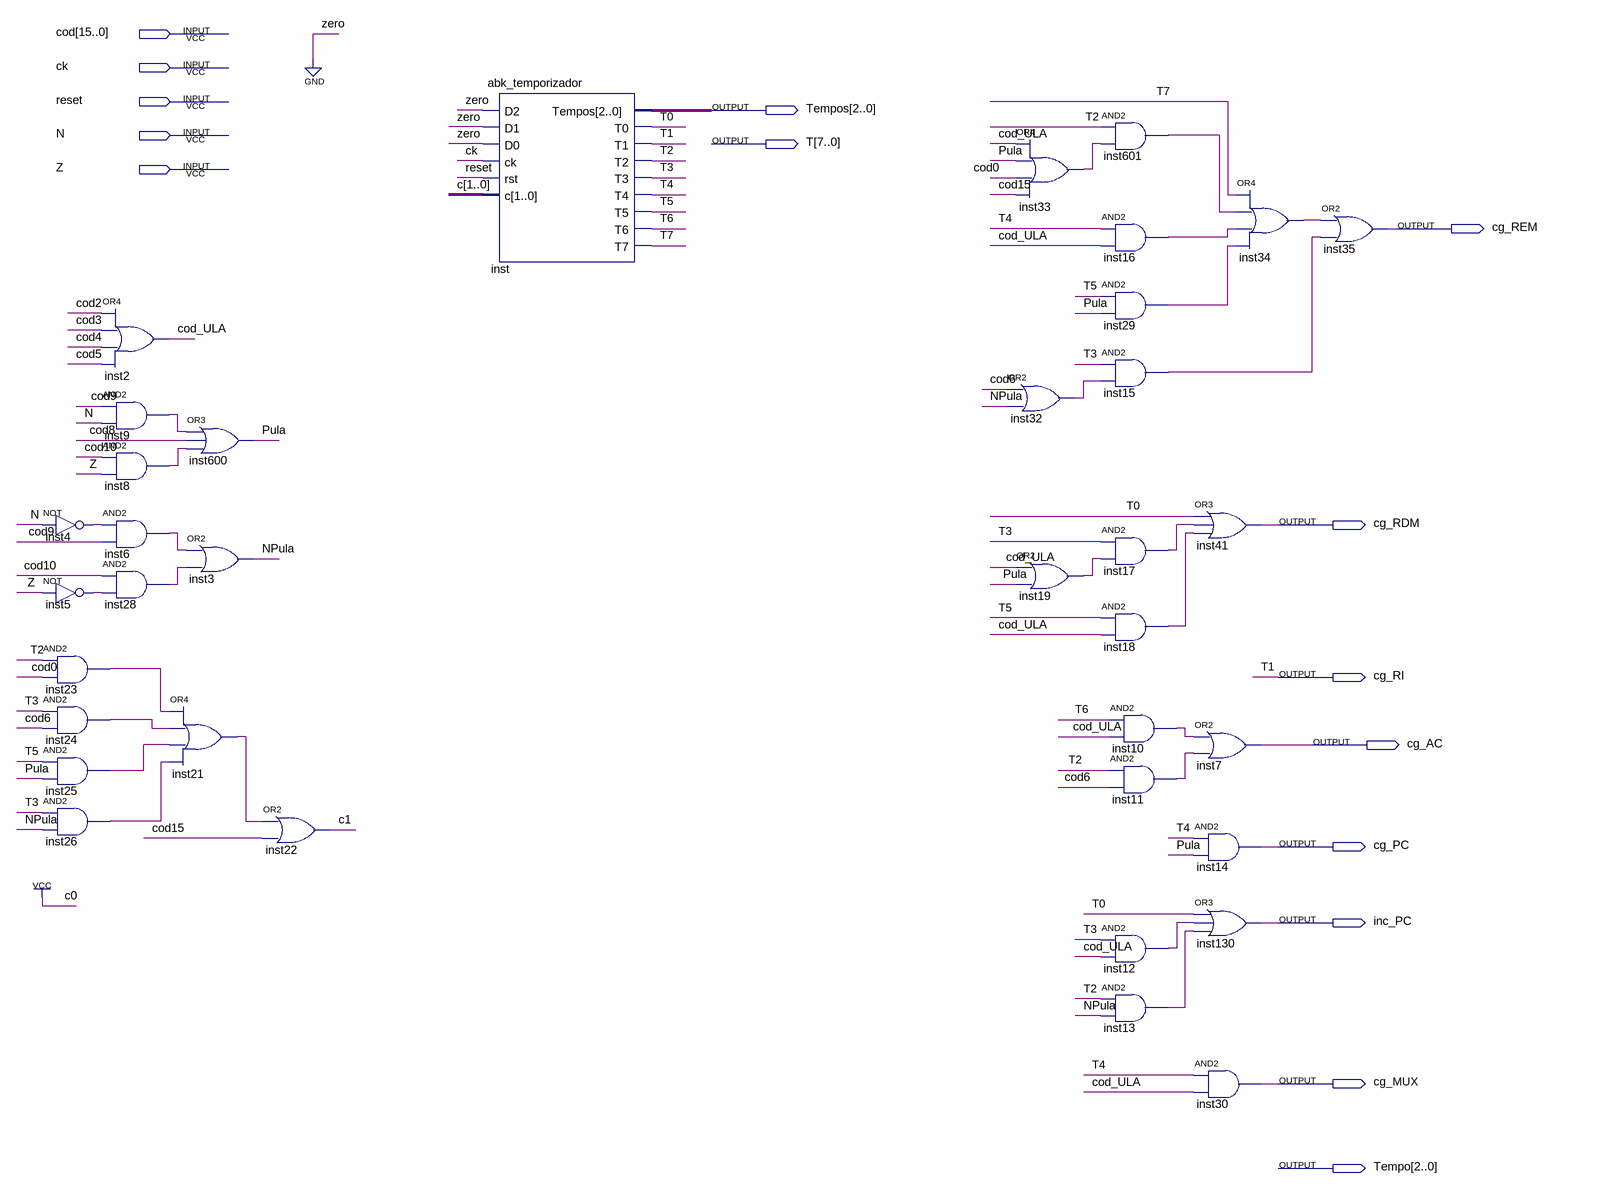
[diagram p0: schematic sheet]
// Quartus schematic abk_novo_cerebro.bdf as structural Verilog: 36 symbols, 15 pins
module abk_novo_cerebro (
  input  [15:0] cod,
  input  ck,
  input  reset,
  input  N,
  input  Z,
  output [2:0] Tempos,
  output [7:0] T,
  output cg_REM,
  output cg_RDM,
  output cg_RI,
  output cg_AC,
  output cg_PC,
  output inc_PC,
  output cg_MUX,
  output [2:0] Tempo
);

  wire cod_ULA, inst4_out, inst5_out, inst6_out, inst8_out, inst9_out, inst10_out, inst11_out, inst12_out,
       inst13_out, inst15_out, inst16_out, inst17_out, inst18_out, inst19_out, inst21_out, inst23_out,
       inst24_out, inst25_out, inst26_out, inst28_out, inst29_out, inst32_out, inst33_out, inst34_out,
       inst601_out, NPula, Pula;
  wire [1:1] c;

  not inst4 (inst4_out, N);
  not inst5 (inst5_out, Z);
  and inst23 (inst23_out, T[2], cod[0]);
  and inst24 (inst24_out, T[3], cod[6]);
  and inst25 (inst25_out, T[5], Pula);
  and inst26 (inst26_out, T[3], NPula);
  or inst2 (cod_ULA, cod[2], cod[3], cod[4], cod[5]);
  and inst9 (inst9_out, cod[9], N);
  and inst8 (inst8_out, cod[10], Z);
  and inst6 (inst6_out, inst4_out, cod[9]);
  and inst28 (inst28_out, cod[10], inst5_out);
  or inst21 (inst21_out, inst23_out, inst24_out, inst25_out, inst26_out);
  or inst600 (Pula, inst9_out, cod[8], inst8_out);
  or inst3 (NPula, inst6_out, inst28_out);
  or inst22 (c[1], inst21_out, cod[15]);
  abk_temporizador inst (
    .D2(1'b0), .D1(1'b0), .D0(1'b0), .ck(ck), .rst(reset), .c({c[1], 1'b1}), .Tempos(Tempos), .T0(T[0]),
    .T1(cg_RI), .T2(T[2]), .T3(T[3]), .T4(T[4]), .T5(T[5]), .T6(T[6]), .T7(T[7]));
  or inst33 (inst33_out, cod_ULA, Pula, cod[0], cod[15]);
  or inst32 (inst32_out, cod[6], NPula);
  or inst19 (inst19_out, cod_ULA, Pula);
  and inst601 (inst601_out, T[2], inst33_out);
  and inst16 (inst16_out, T[4], cod_ULA);
  and inst29 (inst29_out, T[5], Pula);
  and inst15 (inst15_out, T[3], inst32_out);
  and inst17 (inst17_out, T[3], inst19_out);
  and inst18 (inst18_out, T[5], cod_ULA);
  and inst10 (inst10_out, T[6], cod_ULA);
  and inst11 (inst11_out, T[2], cod[6]);
  and inst12 (inst12_out, T[3], cod_ULA);
  and inst13 (inst13_out, T[2], NPula);
  or inst41 (cg_RDM, T[0], inst17_out, inst18_out);
  or inst7 (cg_AC, inst10_out, inst11_out);
  and inst14 (cg_PC, T[4], Pula);
  or inst130 (inc_PC, T[0], inst12_out, inst13_out);
  and inst30 (cg_MUX, T[4], cod_ULA);
  or inst34 (inst34_out, T[7], inst601_out, inst16_out, inst29_out);
  or inst35 (cg_REM, inst34_out, inst15_out);

  assign T[1] = cg_RI;

  // Other names for the same wires on the sheet: T1 = cg_RI
endmodule
